# Altium schematic sheet Sheet1.SchDoc
size A3; SheetNumber: 1; SheetTotal: 1
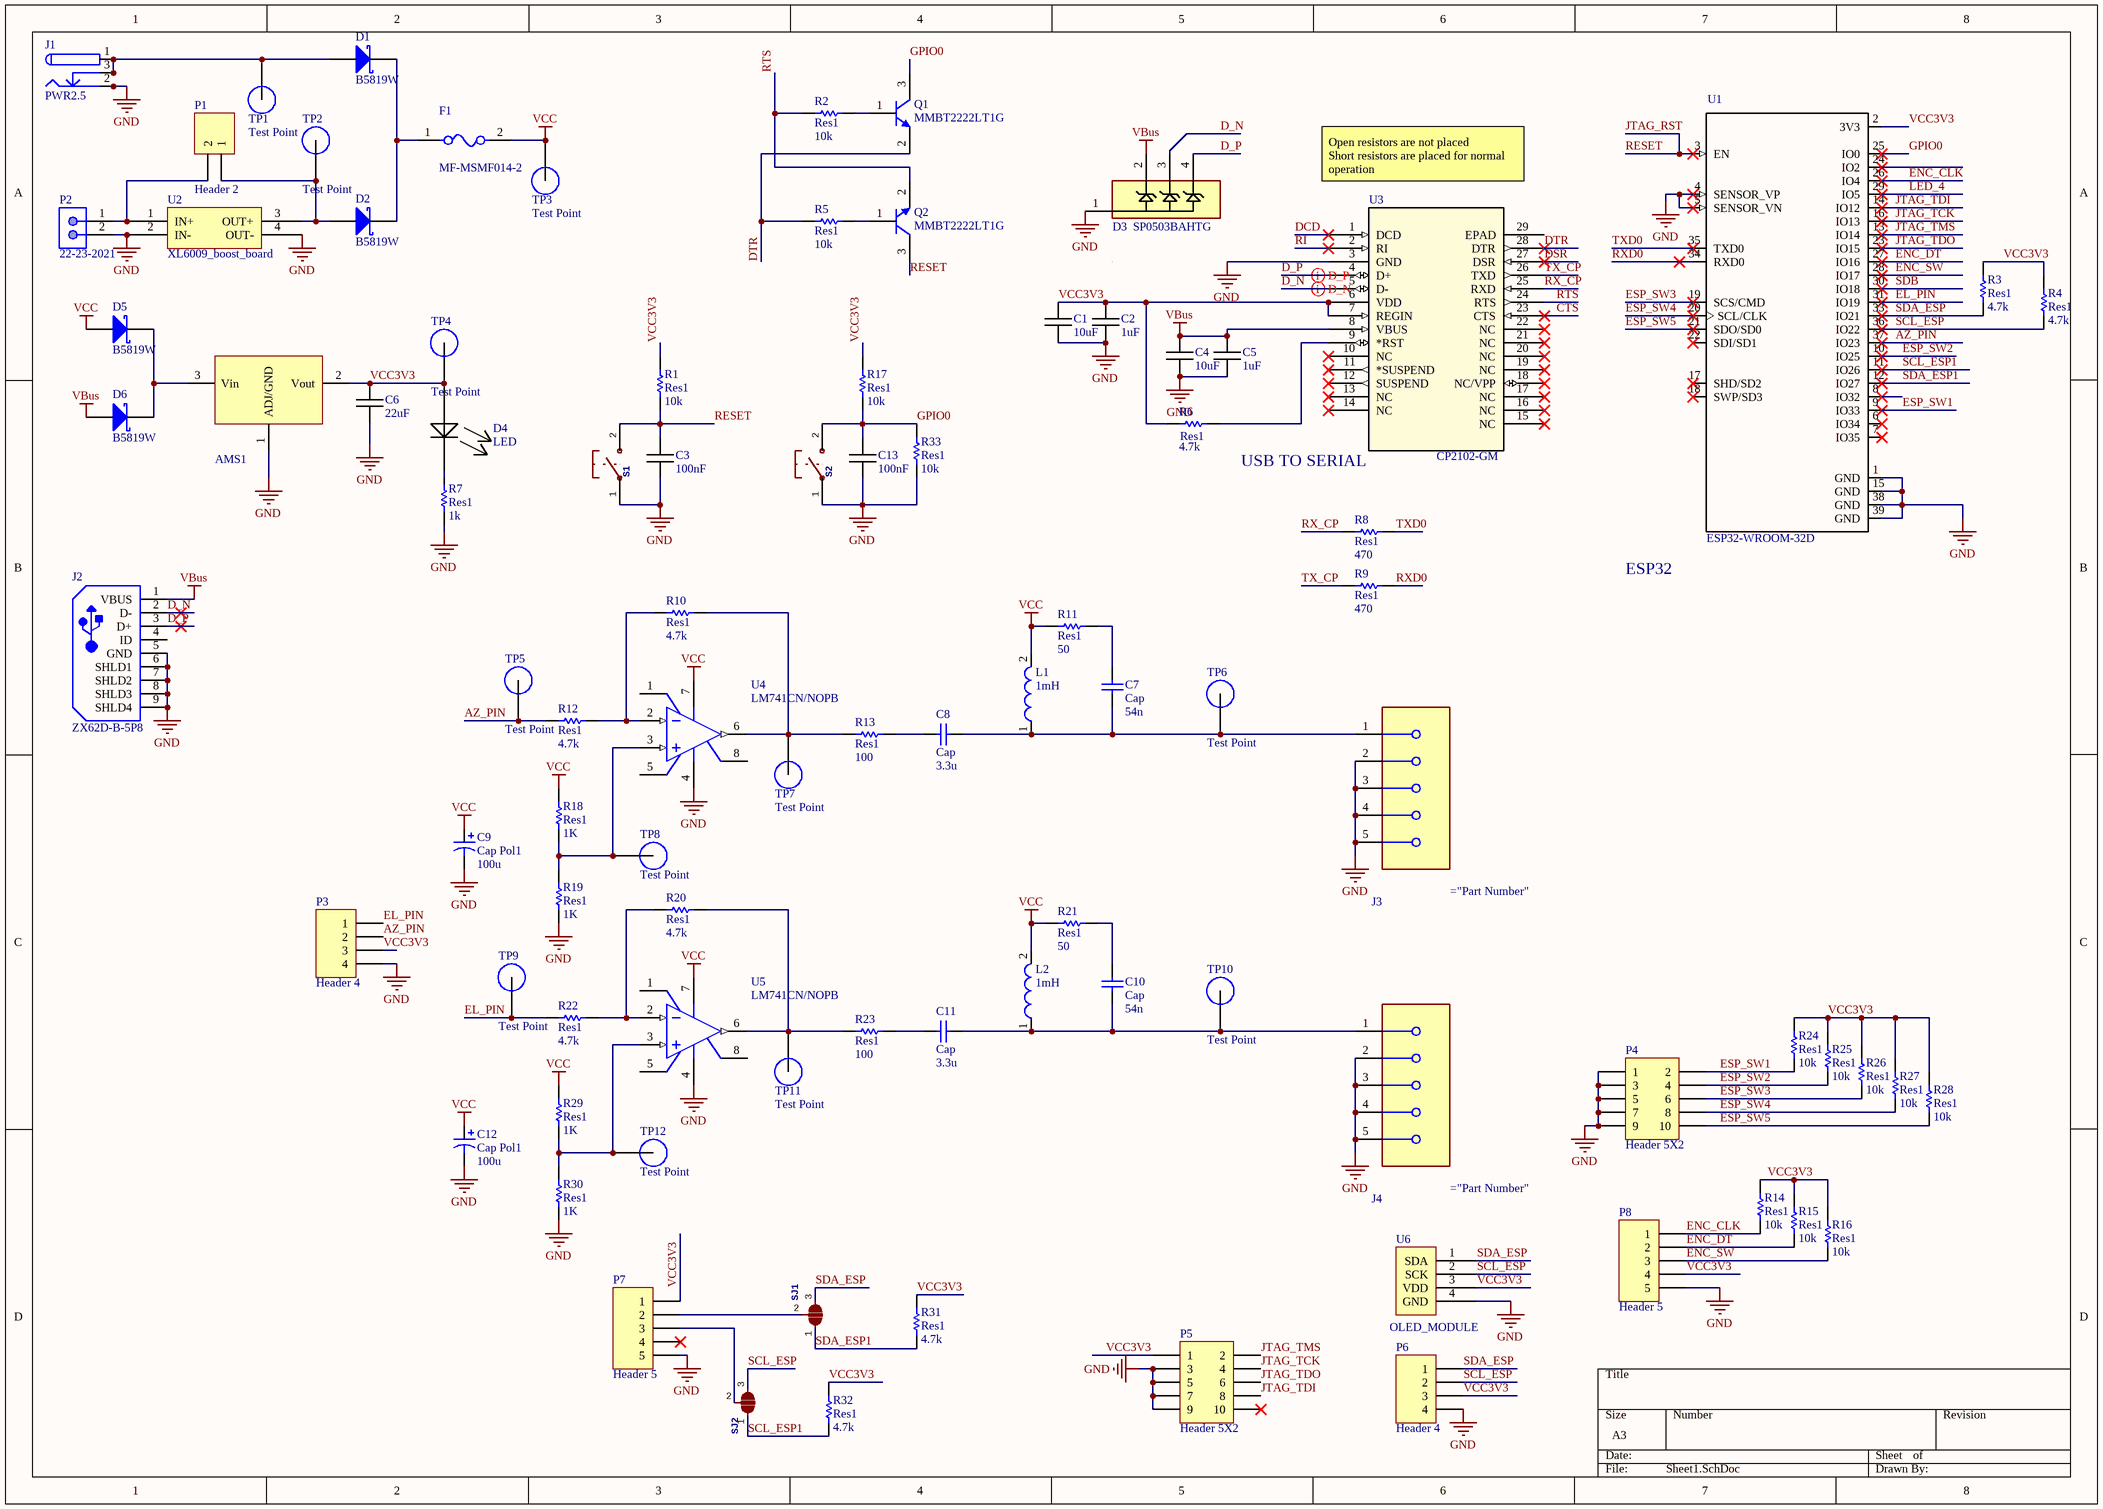
[diagram p0: Sheet1.SchDoc]

## Parts
AMS1  AMS1117  [SOT-223-3]  (value not drawn)
C1  10uF  [C 0603 / 1608]
C2  1uF  [C 0603 / 1608]
C3  100nF  [C 0603 / 1608]
C4  10uF  [C 0603 / 1608]
C5  1uF  [C 0603 / 1608]
C6  22uF  [C 0603 / 1608]
C7  Cap  value 54n  [C 0603 / 1608]
C8  Cap  value 3.3u  [C 0603 / 1608]
C9  Cap Pol1  value 100u  [CAP0603R]
C10  Cap  value 54n  [C 0603 / 1608]
C11  Cap  value 3.3u  [C 0603 / 1608]
C12  Cap Pol1  value 100u  [CAP0603P]
C13  100nF  [C 0603 / 1608]
D1  B5819W  [MCC-SOD123_V]
D2  B5819W  [MCC-SOD123_V]
D3  Part Number: SP0503BAHTG  [Littelfuse_SP0503BAHTG_0]  (hidden comment: Diode_Littelfuse_SP0503BAHTG_eec)
D4  LED  [LED 0603(2)]
D5  B5819W  [MCC-SOD123_V]
D6  B5819W  [MCC-SOD123_V]
F1  MF-MSMF014-2  [FP-MF-MSMF-1-MFG]
J1  PWR2.5  [Barrel_Jack_5mm]
J2  ZX62D-B-5P8  [HIRO-ZX62D-B-5P8_V]
J3  5-1634552-1  [TE_5-1634552-1_0]  (value not drawn)
J4  5-1634552-1  [TE_5-1634552-1_0]  (value not drawn)
L1  1mH  [WE-TI-LS]
L2  1mH  [WE-TI-LS]
P1  Header 2  [HDR1X2]
P2  22-23-2021  [MOLX-22-23-2021_V]
P3  Header 4  [HDR1X4]
P4  Header 5X2  [HDR2X5]
P5  Header 5X2  [HDR2X5]
P6  Header 4  [HDR1X4]
P7  Header 5  [HDR1X5]
P8  Header 5  [HDR1X5]
Q1  MMBT2222LT1G  [ONSC-SOT-23-3-318-08_M]
Q2  MMBT2222LT1G  [ONSC-SOT-23-3-318-08_M]
R1  Res1  value 10k  [C 0603 / 1608]
R2  Res1  value 10k  [C 0603 / 1608]
R3  Res1  value 4.7k  [C 0603 / 1608]
R4  Res1  value 4.7k  [C 0603 / 1608]
R5  Res1  value 10k  [C 0603 / 1608]
R6  Res1  value 4.7k  [C 0603 / 1608]
R7  Res1  value 1k  [C 0603 / 1608]
R8  Res1  value 470  [C 0603 / 1608]
R9  Res1  value 470  [C 0603 / 1608]
R10  Res1  value 4.7k  [RES0603R]
R11  Res1  value 50  [RES0603R]
R12  Res1  value 4.7k  [RES0603R]
R13  Res1  value 100  [RES0603R]
R14  Res1  value 10k  [C 0603 / 1608]
R15  Res1  value 10k  [C 0603 / 1608]
R16  Res1  value 10k  [C 0603 / 1608]
R17  Res1  value 10k  [C 0603 / 1608]
R18  Res1  value 1K  [RES0603R]
R19  Res1  value 1K  [RES0603R]
R20  Res1  value 4.7k  [RES0603R]
R21  Res1  value 50  [RES0603R]
R22  Res1  value 4.7k  [RES0603R]
R23  Res1  value 100  [RES0603R]
R24  Res1  value 10k  [C 0603 / 1608]
R25  Res1  value 10k  [C 0603 / 1608]
R26  Res1  value 10k  [C 0603 / 1608]
R27  Res1  value 10k  [C 0603 / 1608]
R28  Res1  value 10k  [C 0603 / 1608]
R29  Res1  value 1K  [RES0603R]
R30  Res1  value 1K  [RES0603R]
R31  Res1  value 4.7k  [C 0603 / 1608]
R32  Res1  value 4.7k  [C 0603 / 1608]
R33  Res1  value 10k  [C 0603 / 1608]
S1  Switch  [PUSH_SMD_3x4]  (value not drawn)
S2  Switch  [PUSH_SMD_3x4]  (value not drawn)
SJ1  2-Way Solder Jumper  [SOLDERJUMPER_2WAY_OPEN_NOPASTE]  (value not drawn)
SJ2  2-Way Solder Jumper  [SOLDERJUMPER_2WAY_OPEN_NOPASTE]  (value not drawn)
TP1  Test Point  [Test POint]
TP2  Test Point  [Test POint]
TP3  Test Point  [Test POint]
TP4  Test Point  [Test POint]
TP5  Test Point  [Test POint]
TP6  Test Point  [Test POint]
TP7  Test Point  [Test POint]
TP8  Test Point  [Test POint]
TP9  Test Point  [Test POint]
TP10  Test Point  [Test POint]
TP11  Test Point  [Test POint]
TP12  Test Point  [Test POint]
U1  ESP32-WROOM-32D  [MODULE_ESP32-WROOM-32D]
U2  XL6009_boost_board  [XL6009_board]
U3  CP2102-GM  [QFN28_5X5]
U4  LM741CN/NOPB  [P0008A]
U5  LM741CN/NOPB  [P0008A]
U6  OLED_MODULE  [OLED_MODULE]

## Nets
GND: AMS1.1(ADJ/GND) C1.1 C2.1 C3.2 C4.1 C5.1 C6.1 C9.2 C12.2 C13.2 D3.1(COMMON_ANODE) J1.2 J1.2A J1.2B J2.5(GND) J2.6(SHLD1) J2.7(SHLD2) J2.8(SHLD3) J2.9(SHLD4) J3.2(MNT_1) J3.3(MNT_2) J3.4(MNT_3) J3.5(MNT_4) J4.2(MNT_1) J4.3(MNT_2) J4.4(MNT_3) J4.5(MNT_4) P2.2 P3.4 P4.1 P4.3 P4.5 P4.7 P4.9 P5.3 P5.5 P5.7 P5.9 P6.4 P7.5 P8.5 R7.2 R19.1 R30.1 R33.2 S1.1(P$1) S2.1(P$1) U1.1(GND) U1.4(SENSOR_VP) U1.5(SENSOR_VN) U1.15(GND) U1.38(GND) U1.39(GND) U2.2(IN-) U2.4(OUT-) U3.3(GND) U4.4(V-) U5.4(V-) U6.4(GND)
VBus: C4.2 C5.2 D3.2(1_CATHODE) D6.1(A) J2.1(VBUS) U3.8(VBUS)
VCC: C9.1 C12.1 D5.1(A) F1.2 L1.2 L2.2 R11.2 R18.2 R21.2 R29.2 TP3.1 U4.7(V+) U5.7(V+)
AZ_PIN: P3.2 R12.1 TP5.1 U1.37(IO23)
CTS: U3.23(CTS)
D_N: D3.3(2_CATHODE) J2.2(D-) U3.5(D-)
D_P: D3.4(3_CATHODE) J2.3(D+) U3.4(D+)
DCD: U3.1(DCD)
DSR: U3.27(DSR)
DTR: Q1.2(E) R5.1 U3.28(DTR)
EL_PIN: P3.1 R22.1 TP9.1 U1.31(IO19)
ENC_CLK: P8.1 R14.1 U1.26(IO4)
ENC_DT: P8.2 R15.1 U1.27(IO16)
ENC_SW: P8.3 R16.1 U1.28(IO17)
ESP_SW1: P4.2 R24.1 U1.9(IO33)
ESP_SW2: P4.4 R25.1 U1.10(IO25)
ESP_SW3: P4.6 R26.1 U1.19(SCS/CMD)
ESP_SW4: P4.8 R27.1 U1.20(SCL/CLK)
ESP_SW5: P4.10 R28.1 U1.21(SDO/SD0)
GPIO0: C13.1 Q1.3(C) R17.2 R33.1 S2.2(P$2) U1.25(IO0)
JTAG_RST: C3.1 Q2.3(C) R1.2 S1.2(P$2) U1.3(EN)  [also labelled RESET]
JTAG_TCK: P5.4 U1.16(IO13)
JTAG_TDI: P5.8 U1.14(IO12)
JTAG_TDO: P5.6 U1.23(IO15)
JTAG_TMS: P5.2 U1.13(IO14)
LED_4: U1.29(IO5)
RI: U3.2(RI)
RTS: Q2.2(E) R2.1 U3.24(RTS)
RX_CP: R8.1 U3.25(RXD)
RXD0: R9.2 U1.34(RXD0)
SCL_ESP: P6.2 R4.2 SJ2.3 U1.36(IO22) U6.2(SCK)
SCL_ESP1: R32.2 SJ2.1 U1.11(IO26)
SDA_ESP: P6.1 R3.2 SJ1.3 U1.33(IO21) U6.1(SDA)
SDA_ESP1: R31.2 SJ1.1 U1.12(IO27)
SDB: U1.30(IO18)
TX_CP: R9.1 U3.26(TXD)
TXD0: R8.2 U1.35(TXD0)
VCC3V3: AMS1.2(Vout) C1.2 C2.2 C6.2 D4.1(+) P3.3 P5.1 P6.3 P7.1 P8.4 R1.1 R3.1 R4.1 R6.1 R14.2 R15.2 R16.2 R17.1 R24.2 R25.2 R26.2 R27.2 R28.2 R31.1 R32.1 TP4.1 U1.2(3V3) U3.6(VDD) U3.7(REGIN) U6.3(VDD)
NetAMS1_3: AMS1.3(Vin) D5.2(K) D6.2(K)
NetC7_1: C7.1 R11.1
NetC7_2: C7.2 C8.2 J3.1 L1.1 TP6.1
NetC8_1: C8.1 R13.2
NetC10_1: C10.1 R21.1
NetC10_2: C10.2 C11.2 J4.1 L2.1 TP10.1
NetC11_1: C11.1 R23.2
NetD1_1: D1.1(A) J1.1 J1.1A J1.1B J1.3 J1.3A J1.3B TP1.1
NetD1_2: D1.2(K) D2.2(K) F1.1
NetD2_1: D2.1(A) P1.1 TP2.1 U2.3(OUT+)
NetD4_2: D4.2(-) R7.1
NetP1_2: P1.2 P2.1 U2.1(IN+)
NetP7_2: P7.2 SJ1.2
NetP7_3: P7.3 SJ2.2
NetQ1_1: Q1.1(B) R2.2
NetQ2_1: Q2.1(B) R5.2
NetR6_2: R6.2 U3.9(*RST)
NetR10_1: R10.1 R12.2 U4.2(IN-)
NetR10_2: R10.2 R13.1 TP7.1 U4.6(OUT)
NetR18_1: R18.1 R19.2 TP8.1 U4.3(IN+)
NetR20_1: R20.1 R22.2 U5.2(IN-)
NetR20_2: R20.2 R23.1 TP11.1 U5.6(OUT)
NetR29_1: R29.1 R30.2 TP12.1 U5.3(IN+)

Not connected (* = marked no-connect by the designer): J2 4(ID); P5 10*; P7 4*; U1 6(IO34)* 7(IO35)* 8(IO32)* 17(SHD/SD2)* 18(SWP/SD3)* 22(SDI/SD1)* 24(IO2)*; U3 10(NC)* 11(*SUSPEND)* 12(SUSPEND)* 13(NC)* 14(NC)* 15(NC)* 16(NC)* 17(NC)* 18(NC/VPP)* 19(NC)* 20(NC)* 21(NC)* 22(NC)* 29(EPAD); U4 1(OFS_NULL) 5(OFS_NULL) 8(NC); U5 1(OFS_NULL) 5(OFS_NULL) 8(NC)

## Layout directives
differential pair: D_N, D_P

## Notes on the sheet
- Open resistors are not placed
  Short resistors are placed for normal operation
- USB TO SERIAL
- ESP32

## Library data of the parts
AMS1 = AMS1117: LDO 3.3V/5V/12V
C1-C6 C13 = Capacitor
C7 C8 C10 C11 = Cap: Capacitor; Published: 8-Jun-2000; LatestRevisionDate: 17-Jul-2002; LatestRevisionNote: Re-released for DXP Platform.; PackageReference: RAD-0.3; Publisher: Altium Limited; PackageDescription: Radial Cap, Thru-Hole; 2 Leads; 0.3 in Pin Spacing
C9 C12 = Cap Pol1: Polarized Capacitor (Radial); Published: 8-Jun-2000; LatestRevisionDate: 17-Jul-2002; LatestRevisionNote: Re-released for DXP Platform.; PackageReference: RB7.6-15; Publisher: Altium Limited; PackageDescription: Polarized Capacitor (Radial); 2 Leads
D1 D2 D5 D6 = CMP-2100-03587-1: Schottky Barrier Rectifier, 1 A, 40 Vrm, -65 to 125 degC, 2-Pin SOD123, RoHS, Tape and Reel; Manufacturer: Micro Commercial Components; Package Description: 2-Pin Small Outline Diode, Body 2.7 x 1.6 mm, Height 1.35 mm; Datasheet URL: http://www.mccsemi.com/up_pdf/B5817W-B5819W(SOD-123).pdf; Manufacturer URL: http://www.mccsemi.com/; Package Reference: SOD123; Package URL: http://www.mccsemi.com/up_pdf/1N4448W(SOD-123).pdf; Datasheet Version: Rev. B, 01/2013
D3 = Diode_Littelfuse_SP0503BAHTG_eec: DIODE TVS DIODE 5.5VWM 8.5VC SOT143; helpURL: https://upverter.com/upn/revision/6b5b591e3bf31c16/; ComponentLink2Description: Datasheet; Temperature: -40°C to +85°C; Package: SOT143-4; Supplier 2: Mouser; Price: 0.571399033067; Supplier 1: Digi-Key; ComponentLink1URL: https://upverter.com/upn/revision/6b5b591e3bf31c16/; Supplier Part Number 2: 576-SP0503BAHTG; Supplier Part Number 1: F2715CT-ND; Manufacturer: Littelfuse; ComponentLink1Description: Upverter; ComponentLink2URL: http://www.littelfuse.com/~/media/electronics/datasheets/tvs_diode_arrays/littelfuse_tvs_diode_array_sp05_datasheet.pdf.pdf; RoHS: TRUE; Mouser Part Number: 576-SP0503BAHTG; Temperature Range High: +85°C; Digikey Description: DIODE TVS DIODE 5.5VWM 8.5VC SOT143; Digikey Part Number: F2715CT-ND; Lead Free: yes; Temperature Range Low: -40°C
F1 = CMP-07400-000016-1: PTC RESET FUSE 60V 140MA 1812; Manufacturer: Bourns; Resistance: 0.4-6.5Ω; Automotive Grade: Grade 3; Hold Current: 0.14A; Value: 0.4-6.5Ω; Trip Current: 0.34A; Current Rating: 40A; Trip Time: 0.15s; Digikey Description: PTC RESET FUSE 60V 140MA 1812; Category: Fuse; RoHS: TRUE; Lead Free: Yes; Ambient Temperature Range High: +85°C; ComponentLink2Description: Datasheet; ComponentLink2URL: https://www.bourns.com/pdfs/mfmsmf.pdf; Mouser Description: Resettable Fuses - PPTC 0.14A 60V 0.40ohm; Voltage Rating: 60V; Automotive: Yes; Height: 1.1mm; Manufacturer Part Number: MF-MSMF014-2; Temperature: -40°C to +85°C; Ambient Temperature Range Low: -40°C; Temperature Range High: +85°C; Device Class L1: Circuit Protection; Package: MF-MSMF-1; Device Class L2: PTC Resettable Fuses; Device Class L3: unset; Octopart: https://octopart.com/mf-msmf014-2-bourns-70906; Temperature Range Low: -40°C
J1 = PWR2.5: Low Voltage Power Supply Connector; Published: 17-Dec-2003; DatasheetDocument: 09-May-2002; Publisher: Altium Limited; ComponentLink1Description: Manufacturer Link; ComponentLink1URL: http://domino.kycon.com/internet/Products.html
J2 = CMP-0029-00002-1: Right Angle Receptacle Connector, Micro USB, 30 V(AC), -30 to 85 degC, 5-Pin SMD, RoHS, Tape and Reel; Capacitance: 1 uF; Tolerance: 10%; ESR: 7.5 Ohm; Voltage Rating: 35 V; PackageDescription: USB Connector, 5 Position Surface Mount, Length 8 mm, Height 2.65 mm; DatasheetVersion: Aug-16; REACH SVHC: No SVHC; Package Quantity: 2000; ComponentLink1Description: Manufacturer URL; ComponentLink2URL: https://www.hirose.com/product/en/download_file/key_name/ZX62D-B-5P8/category/Catalog/doc_file_id/31704/?file_category_id=5&item_id=02420034000&is_series=; Length: 3.2 mm; ComponentLink1URL: https://www.hirose.com; Radiation Hardening: No; Height: 1.8 mm; Max Operating Temperature: 125degC; Weight: 0.000571 oz; Min Operating Temperature: -55degC; ComponentLink3Description: Package Specification; Width: 1.6 mm; Case Code (Metric): 3216; Mount: Surface Mount; ComponentLink2Description: Datasheet; Case Code (Imperial): 1206; ComponentLink3URL: https://www.hirose.com/product/en/download_file/key_name/ZX62D-B-5P8/category/Drawing%20(2D)/doc_file_id/36535/?file_category_id=6&item_id=02420034000&is_series=; Pins: 2; Resistance: 7.5 Ohm; Packaging: Tape and Reel; RoHSCompliant: True; Voltage Rating (DC): 35 V; Case/Package: 1206; PackageReference: ZX62D-B-5P8
L1 L2 = CMP-0225-00033-1: Radial Leaded Wire Wound Inductor WE-TI, L = 1000 µH; Inductance: 1000 ÂµH; ComponentLink2URL: http://www.we-online.de/katalog/media/pdf/744741102.pdf; PackageVersion: 2004; PackageReference: WE-TI-LS; ComponentLink2Description: Datasheet; ComponentLink1URL: http://www.we-online.com; DatasheetVersion: ver 2, Nov-2004; ComponentLink1Description: Manufacturer Link; PackageDescription: THT Inductor, 2-Leads, Body 8.0 x 8.0 mm
P1 = Header 2: Header, 2-Pin; LatestRevisionDate: 17-Jul-2002; LatestRevisionNote: Re-released for DXP Platform.; Publisher: Altium Limited
P2 = CMP-1704-00001-3: Male Header, Pitch 2.54 mm, 1 x 2 Position, Height 10.67 mm, Tail Length 3.56 mm, 0 to 75 degC, RoHS, Bulk; Package Quantity: 3000; Height: 10.67 mm; RoHSCompliant: True; ComponentLink2URL: https://datasheet.ciiva.com/19454/232266-19454304.pdf; PartNumber: 22-23-2021; Packaging: Bulk; ComponentLink2Description: Datasheet; Min Operating Temperature: 0 degC; ComponentLink1Description: Manufacturer URL; Length: 5.08 mm; Mounting Technology: Through Hole; Max Operating Temperature: 75 degC; REACH SVHC: Unknown; PackageDescription: Male Header, Pitch 2.54 mm, 1 x 2 Position, Height 10.67 mm, Tail Length 3.56 mm; ComponentLink1URL: http://www.molex.com/; Mount: Through Hole; Radiation Hardening: No; Width: 6.35 mm; Pins: 2
P3 P6 = Header 4: Header, 4-Pin; LatestRevisionDate: 17-Jul-2002; LatestRevisionNote: Re-released for DXP Platform.; Publisher: Altium Limited
P4 P5 = Header 5X2: Header, 5-Pin, Dual row; LatestRevisionDate: 17-Jul-2002; LatestRevisionNote: Re-released for DXP Platform.; Publisher: Altium Limited
P7 P8 = Header 5: Header, 5-Pin; LatestRevisionDate: 17-Jul-2002; LatestRevisionNote: Re-released for DXP Platform.; Publisher: Altium Limited
Q1 Q2 = CMP-0722-00001-1: General Purpose Transistor, NPN, 0.6 A IC Continuous, 3-Pin SOT23, RoHS, Tape and Reel; Manufacturer: ON Semiconductor; PTM Max.: 0.225 W; HFE Max.: 300; HFE Min.: 100; V(BR) CEO: 30 V Min.; FT: 250 MHz; IC Continuous: 0.6 A; RoHS: TRUE; DatasheetVersion: Rev. 10; PackageVersion: Rev. AP; Polarity: NPN; PackageReference: SOT-23-3; PackageDescription: 3-Pin SOT23, Body 2.9 x 1.3 mm, Pitch 0.95 mm; ComponentLink1URL: http://www.onsemi.com/; ComponentLink2URL: http://www.onsemi.com/pub_link/Collateral/MMBT2222LT1-D.PDF; PartNumber: MMBT2222LT1G; ComponentLink3URL: http://www.onsemi.com/pub_link/Collateral/MMBT2222LT1-D.PDF; Mounting Technology: Surface Mount; ComponentLink3Description: Package Specification; ComponentLink1Description: Manufacturer URL; Packing: Tape and Reel; ComponentLink2Description: Datasheet
R1-R33 = Res1: Resistor; Published: 8-Jun-2000; LatestRevisionDate: 17-Jul-2002; LatestRevisionNote: Re-released for DXP Platform.; PackageReference: AXIAL-0.3; Publisher: Altium Limited; PackageDescription: Axial Device, Thru-Hole; 2 Leads; 0.3 in Pin Spacing
S1 S2 = B3U-1000P: MANUFACTURER: Omron; DIGIKEY: SW1020CT-ND; MPN: B3U-1000P
SJ1 SJ2 = SOLDERJUMPER_2WAY
U1 = ESP32-WROOM-32D: IC: SoC; GPIO, I2C, I2S, IR, SD, SDIO, SPI, UART; 2.7Ã·3.6VDC; 20dBm; MF: Espressif Systems; Availability: Warning; SnapEDA_Link: https://www.snapeda.com/parts/ESP32-WROOM-32D/Espressif%20Systems/view-part/?ref=snap; MP: ESP32-WROOM-32D; Price: 3.98 USD; Package: Module Espressif Systems; Value: *
U3 = CP2102-GM: No Description Available; Vendor: Silicon Labs; Built_By: EMA_UL_Team; Manufacturer_Part_Number: CP2102-GM; Copyright: Copyright (C) 2018 Accelerated Designs. All rights reserved; RefDes: RefDes; Type: DEV; Value: Value
U4 U5 = CMP-0055-00162-3: Operational Amplifier, 8-pin MDIP, Pb-Free; Manufacturer: Texas Instruments; PackageTopMarking: NSUZXYTTE#*LM*741CN; PowerWise: N; CompType: Amplifiers; ComponentLink1Description: Datasheet URL; ComponentLink1URL: http://www.ti.com/general/docs/lit/getliterature.tsp?genericPartNumber=LM741&fileType=pdf; PackageDescription: MDIP, .365 x .250 x .130in, 8 Lead, .100in Pitch; RoHS: Y; PinCount: 8; Code_JEDEC: MS-001-BA; Package Reference: P0008A